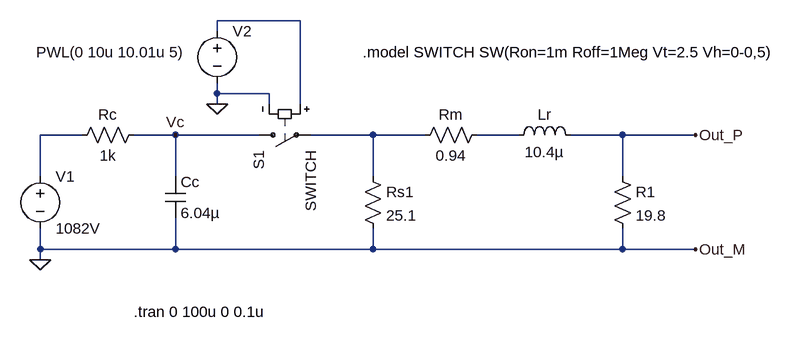
[diagram p0: schematic Surge_Waveform_Generator.asc]
Surge_Waveform_Generator.asc, the LTspice schematic file:
Version 4
SHEET 1 1216 680
WIRE 384 -64 256 -64
WIRE 256 -48 256 -64
WIRE 256 48 256 32
WIRE 336 48 256 48
WIRE 256 64 256 48
WIRE 336 64 336 48
WIRE 384 64 384 -64
WIRE 48 112 -16 112
WIRE 192 112 128 112
WIRE 320 112 192 112
WIRE 496 112 400 112
WIRE 576 112 496 112
WIRE 720 112 656 112
WIRE 880 112 800 112
WIRE 992 112 880 112
WIRE -16 176 -16 112
WIRE 192 176 192 112
WIRE 496 176 496 112
WIRE 880 176 880 112
WIRE -16 288 -16 256
WIRE 192 288 192 240
WIRE 192 288 -16 288
WIRE 496 288 496 256
WIRE 496 288 192 288
WIRE 880 288 880 256
WIRE 880 288 496 288
WIRE 992 288 880 288
WIRE -16 304 -16 288
FLAG -16 304 0
FLAG 192 112 Vc
FLAG 256 64 0
FLAG 992 112 Out_P
FLAG 992 288 Out_M
SYMBOL voltage -16 160 R0
WINDOW 123 0 0 Left 2
WINDOW 39 0 0 Left 2
SYMATTR InstName V1
SYMATTR Value 1082V
SYMBOL res 32 128 R270
WINDOW 0 32 56 VTop 2
WINDOW 3 0 56 VBottom 2
SYMATTR InstName Rc
SYMATTR Value 1k
SYMBOL cap 176 176 R0
SYMATTR InstName Cc
SYMATTR Value 6.04µ
SYMBOL sw 304 112 M90
SYMATTR InstName S1
SYMATTR Value SWITCH
SYMBOL voltage 256 -64 R0
WINDOW 3 -48 48 Right 2
WINDOW 123 0 0 Left 2
WINDOW 39 0 0 Left 2
SYMATTR InstName V2
SYMATTR Value PWL(0 10u 10.01u 5)
SYMBOL res 480 160 R0
SYMATTR InstName Rs1
SYMATTR Value 25.1
SYMBOL res 560 128 R270
WINDOW 0 32 56 VTop 2
WINDOW 3 0 56 VBottom 2
SYMATTR InstName Rm
SYMATTR Value 0.94
SYMBOL ind 704 128 R270
WINDOW 0 32 56 VTop 2
WINDOW 3 5 56 VBottom 2
SYMATTR InstName Lr
SYMATTR Value 10.4µ
SYMBOL res 864 160 R0
SYMATTR InstName R1
SYMATTR Value 19.8
TEXT 128 384 Left 2 !.tran 0 100u 0 0.1u
TEXT 480 -16 Left 2 !.model SWITCH SW(Ron=1m Roff=1Meg Vt=2.5 Vh=0-0,5)

The netlist it stands for:
* Surge_Waveform_Generator.asc
V1 N002 0 1082V
Rc N002 Vc 1k
Cc Vc 0 6.04µ
S1 Vc N003 N001 0 SWITCH
V2 N001 0 PWL(0 10u 10.01u 5)
Rs1 N003 0 25.1
Rm N003 N004 0.94
Lr N004 Out_P 10.4µ
R1 Out_P 0 19.8
.tran 0 100u 0 0.1u
.model SWITCH SW(Ron=1m Roff=1Meg Vt=2.5 Vh=0-0,5)
.backanno
.end